# EAGLE design VoltageSourcePCBV3LT1494 (EAGLE 9.4.2)
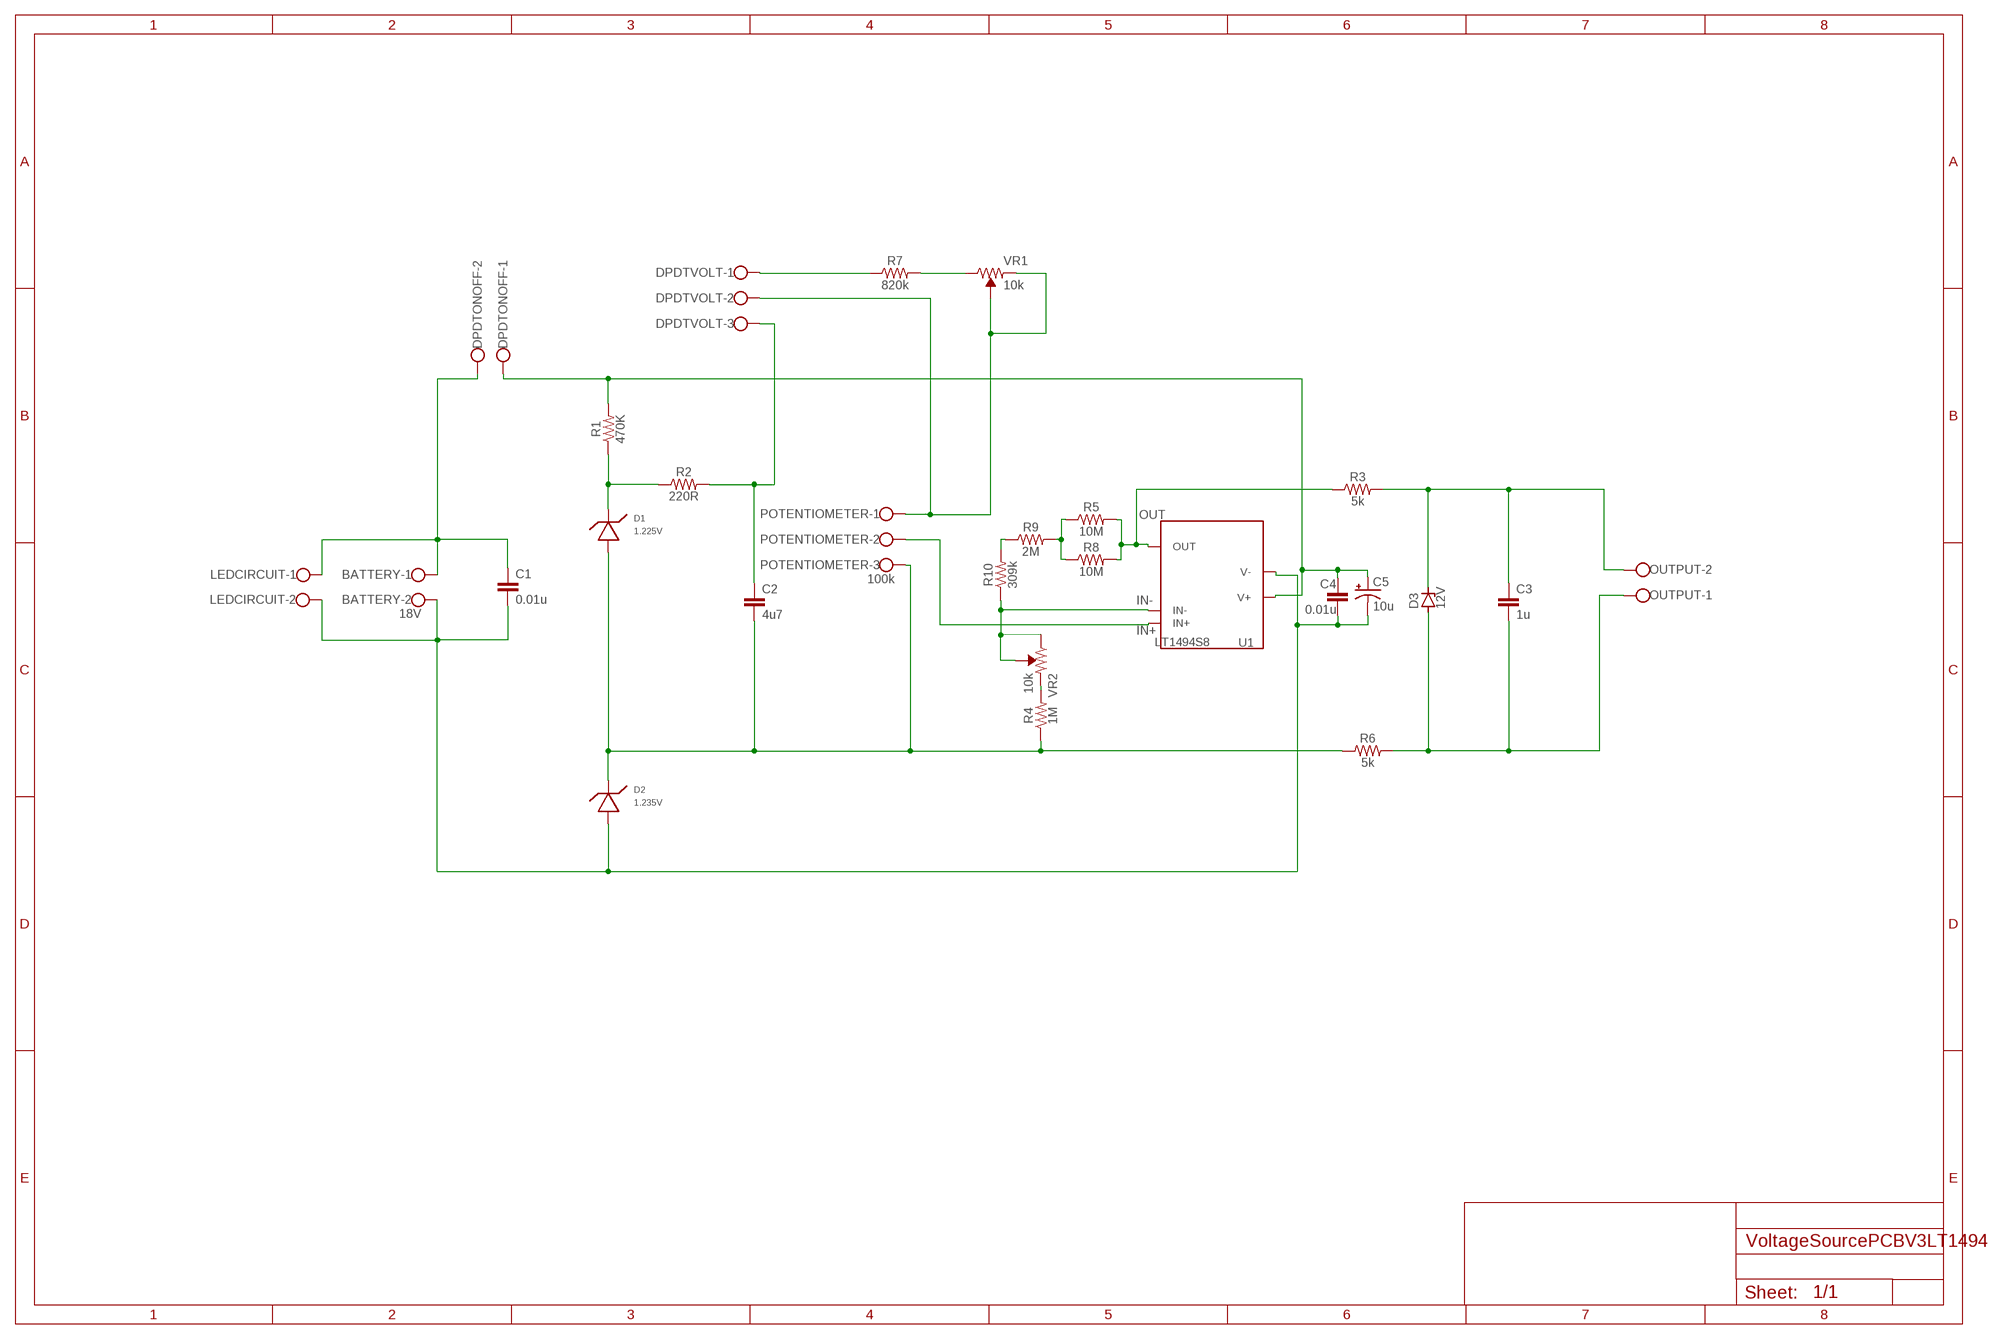
[diagram p0: schematic, sheet 1]

## Parts
BATTERY  18V  W237-102  [W237-102]
C1  0.01u  0.33UF/330NF-0805-50V-10%  [0805]
C2  4u7  0.33UF/330NF-0805-50V-10%  [0805]
C3  1u  0.33UF/330NF-0805-50V-10%  [0805]
C4  0.01u  0.33UF/330NF-0805-50V-10%  [0805]
C5  10u  100UF-POLAR-EIA7343-10V-10%(TANT)  [EIA7343]
D1  1.225V  LT1004CS8SMD  [S8PACKAGE]
D2  1.235V  LM385BDSMD  [SOIC-8PACKAGE]
D3  12V  ZENER-DIODESOT23  [SOT23]
DPDTONOFF  W237-102  [W237-102]
DPDTVOLT  W237-103  [W237-103]
LEDCIRCUIT  W237-102  [W237-102]
OUTPUT  W237-102  [W237-102]
POTENTIOMETER  100k  W237-103  [W237-103]
R1  470K  RESISTOR0805  [0805]
R2  220R  RESISTOR0805  [0805]
R3  5k  RESISTOR0805  [0805]
R4  1M  RESISTOR0805  [0805]
R5  10M  RESISTOR0805  [0805]
R6  5k  RESISTOR0805  [0805]
R7  820k  RESISTOR0805  [0805]
R8  10M  RESISTOR0805  [0805]
R9  2M  RESISTOR0805  [0805]
R10  309k  RESISTOR0805  [0805]
U1  LT1494S8  [S8PACKAGE]
VR1  10k  TRIMPOT-SMD-3MM-OPEN-1/10W-25%  [TRIMPOT-SMD-TC33X]
VR2  10k  TRIMPOT-SMD-3MM-OPEN-1/10W-25%  [TRIMPOT-SMD-TC33X]

## Nets
IN+: POTENTIOMETER.2 U1.3(IN+)
IN-: R10.1 U1.2(IN-) VR2.1(CW) VR2.2(WIPER)
N$2: BATTERY.1 C1.1 DPDTONOFF.2 LEDCIRCUIT.1
N$6: D1.6(CATHODE) D1.8(CATHODE) R1.1 R2.1
N$7: C2.2 D1.4(ANODE) D2.8(CATHODE) POTENTIOMETER.3 R4.1 R6.1
N$8: C2.1 DPDTVOLT.3 R2.2
N$11: DPDTVOLT.2 POTENTIOMETER.1 VR1.2(WIPER) VR1.3(CCW)
N$12: DPDTVOLT.1 R7.1
N$15: R5.1 R8.1 R9.2
N$16: C3.1 D3.3(C) OUTPUT.2 R3.2
N$17: C3.2 D3.1(A) OUTPUT.1 R6.2
N$18: R4.2 VR2.3(CCW)
N$19: R7.2 VR1.1(CW)
N$20: R9.1 R10.2
OUT: R3.1 R5.2 R8.2 U1.6(OUT)
V+: C4.1 C5.A(+) DPDTONOFF.1 R1.2 U1.7(V+)
V-: BATTERY.2 C1.2 C4.2 C5.C(-) D2.4(ANODE) LEDCIRCUIT.2 U1.4(V-)

## Library data of the parts
BATTERY DPDTONOFF LEDCIRCUIT OUTPUT = con-wago-500:W237-102: WAGO SCREW CLAMP; MPN: 237-102; OC_FARNELL: unknown; OC_NEWARK: 70K9898
C1-C4 = SparkFun-Capacitors:0.33UF/330NF: 0.33µF/330nF ceramic capacitors A capacitor is a passive two-terminal electrical component used to store electrical energy temporarily in an electric field.; PROD_ID: CAP-08469; VALUE: 0.33µF
C5 = SparkFun-Capacitors:100UF-POLAR: 100µF polarized capacitors A capacitor is a passive two-terminal electrical component used to store electrical energy temporarily in an electric field.; PROD_ID: CAP-07890; VALUE: 100uF
D1 = RequiredComponents:LT1004CS8: This is a micropower voltage reference (similar to zener diode) and is contained inside of an S8 package
D2 = RequiredComponents:LM385BD: This is a micropower voltage controller, which is similar to a zener diode, in a SOIC-8 package
D3 = diode:ZENER-DIODE: Z-Diode
DPDTVOLT POTENTIOMETER = con-wago-500:W237-103: WAGO SCREW CLAMP; MPN: 237-103; OC_FARNELL: unknown; OC_NEWARK: 18M7116
R1-R10 = SparkFun-Resistors:RESISTOR: Generic Resistor Package
U1 = RequiredComponents:LT1494: The LT1494 is a very low current op-amp that also has a good noise output, powered by a 36V supply (18V each pin)
VR1 VR2 = SparkFun-Resistors:TRIMPOT: Trimming Potentiometer (Trimpot) Three-terminal potentiometers, with an adjustable wiper and two adjustable resistors. A pot can be used to create a configurable voltage divider, or as a variable resistor. "Trimpots" are a subset of potentiometers, usually intended for "set-and-forget" applications. They're often more delicate than standard potentiometers - rated for fewer turns. Variants PTH-KNOB - PTH Trimpot w/ finger-adjustable knob Trimpot 10K with Knob <https://www.sparkfun.com/products/9806> (COM-09806) Datasheet <http://www.sparkfun.com/datasheets/Components/General/TSR-3386.pdf> SMD-3MM-CLOSED-FRAME - SMD 3mm Square Closed-Frame Trimpot Used on e.g. EasyDriver - Stepper Motor Driver <https://www.sparkfun.com/products/12779> Datasheet <http://www.bitechnologies.com/pdfs/22.pdf> (22AR10KTR) SMD-5MM - SMD 5mm Square Closed-Frame Trimpot Used on e.g. IOIO-OTG - V2.2 <https://www.sparkfun.com/products/13613> Datasheet <http://www.vishay.com/docs/51008/ts53.pdf> (TS53YL502MR10) SMD-3MM-1/10W-25% - 3mm Square Open-Frame Trimpot Used on e.g. SparkFun Shapeoko <https://www.sparkfun.com/products/13899> Datasheet <http://www.bourns.com/docs/Product-Datasheets/TC33.pdf> (TC33X-2-103E); PROD_ID: RES-12428, RES-08048

## Board
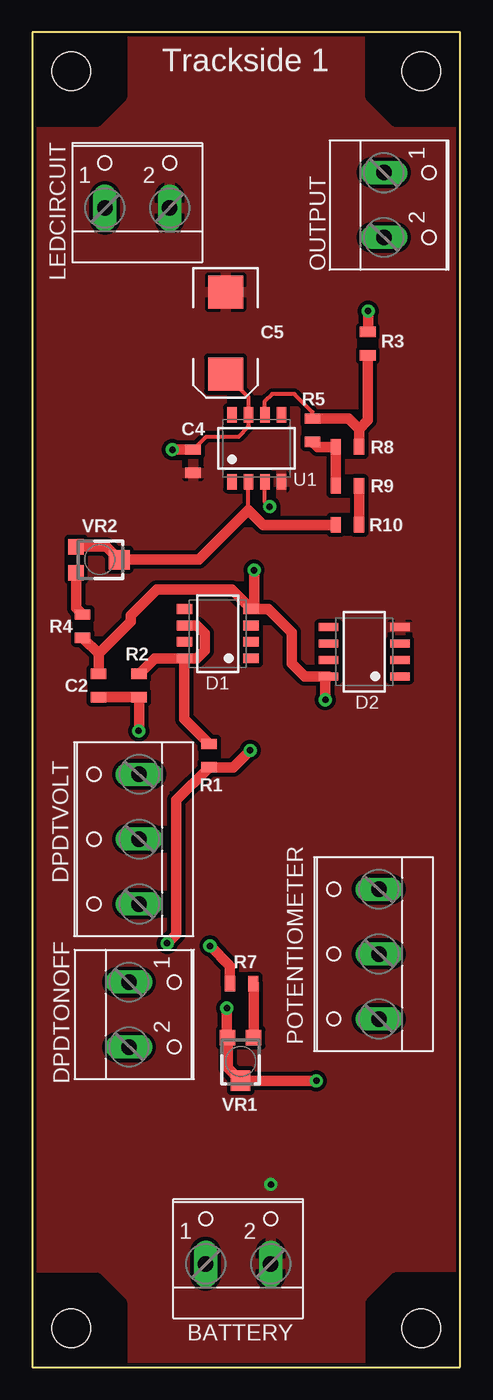
[diagram p1: board, top side]
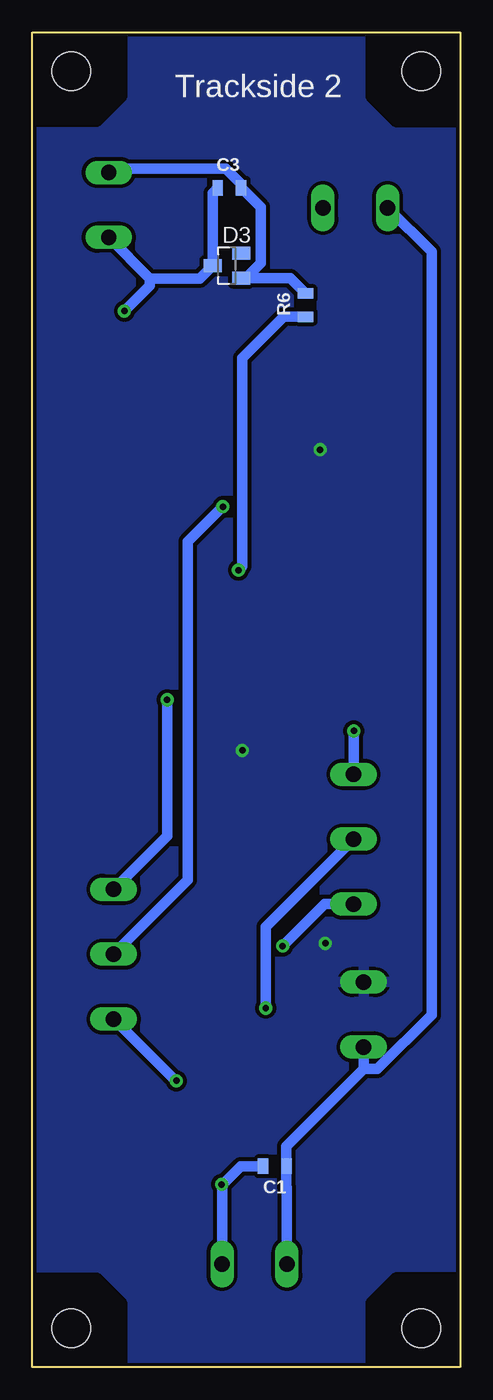
[diagram p2: board, bottom side, seen from below]

Size 33 x 103 mm. Coordinates in mm from the lower left corner, seen from the top.
Outline: 33,0 33,103
Outline: 33,103 0,103
Outline: 33,0 33,103
Outline: 33,103 0,103
Outline: 0,103 0,0 33,0
Copper layers (1*16): Top 0.035mm / dielectric 1.5mm / Bottom 0.035mm
Design rules "PCBTrain": minimum track width 8mil, minimum drill 0.2mm, track to track 0.3mm, track to pad 0.3mm, pad to pad 8mil, via to via 8mil, smd to smd 8mil, copper to edge 0.25mm, drill to drill 8mil, minimum pad ring 12mil, minimum via ring 10mil, stop-mask expansion 4mil, vias tented up to drill 20mil, thermal gap 10mil
Holes 3 mm at 3,3 30,3 3,100 30,100
tRestrict: 12 lines
bRestrict: 12 lines

### Footprints (pad centres in the part's own frame; a part is rotated, then mirrored left to right if it is on the bottom)
W237-102 = drill 1.194 long: 1 -2.5,-1.27; 2 2.5,-1.27
0805 = smd 0.8 x 1.2: 1 -0.9,0; 2 0.9,0
EIA7343 = smd 2.55 x 2.7: A 3.17,0; C -3.17,0
S8PACKAGE = smd 0.75 x 1.2: 1 -1.905,-2.578; 2 -0.635,-2.578; 3 0.635,-2.578; 4 1.905,-2.578; 5 1.905,2.578; 6 0.635,2.578; 7 -0.635,2.578; 8 -1.905,2.578
SOIC-8PACKAGE = smd 0.6 x 1.52: 1 -1.905,-2.76; 2 -0.635,-2.76; 3 0.635,-2.76; 4 1.905,-2.76; 5 1.905,2.76; 6 0.635,2.76; 7 -0.635,2.76; 8 -1.905,2.76
SOT23 = smd 1 x 1.4: 1 -0.95,-1.1; 2 0.95,-1.1; 3 0,1.1
W237-103 = drill 1.194 long: 1 -5,-1.29; 2 0,-1.29; 3 5,-1.29
TRIMPOT-SMD-TC33X = smd 1.2 x 1.2: 1 -1,-1.825; 3 1,-1.825 | smd 1.5 x 1.6: 2 0,1.5

### Placement (x,y rotation side)
BATTERY  15.87,9.23 0 top
C1  14.3,15.5 180 bottom
C2  5.1,52.6 90 top
C3  17.8,91 0 bottom
C4  12.4,69.9 270 top
C5  14.9,79.8 270 top
D1  14.3,56.6 90 top
D2  25.6,55.2 90 top
D3  18,85 90 bottom
DPDTONOFF  8.72,27.21 270 top
DPDTVOLT  6.94,40.74 90 top
LEDCIRCUIT  8.09,90.72 0 top
OUTPUT  28.38,89.68 270 top
POTENTIOMETER  25.44,31.87 90 top
R1  13.63,47.19 270 top
R2  8.23,52.6 270 top
R3  25.87,78.99 90 top
R4  3.87,57.18 90 top
R5  21.6,72.3 90 top
R6  11.92,81.95 90 bottom
R7  16.14,29.58 0 top
R8  24.3,71 0 top
R9  24.3,68 180 top
R10  24.3,65 0 top
U1  17.3,70.9 0 top
VR1  16.06,23.6 180 top
VR2  5.2,62.31 270 top

### Tracks (layer width: path | path; a pad name or v marks a point on that pad's centre or on a via)
IN+  (via drill 0.5)
  Top 0.305: v18.3,66.4 17.93,66.77 U1.3
  Bottom 0.813: v18.3,66.4 21,63.7 21,37.6 POTENTIOMETER.2
IN-
  Top 0.305: 16.66,66.14 U1.2
  Top 0.813: VR2.1 5.7,63.31 VR2.2 12.84,62.31 16.66,66.14 17.8,65 R10.1
N$2
  Bottom 0.813: DPDTONOFF.2 7.45,23 | BATTERY.1 13.37,13.87 13.4,13.9 C1.1 13.4,17.05 7.45,23 | 7.45,23 6.4,23 2.2,27.2 2.2,86.06 LEDCIRCUIT.1
N$6
  Top 0.813: R2.1 9.43,54.7 D1.8 | R1.1 11.72,50 D1.8 | D1.8 12.7,54.7 13.3,55.3 13.3,56.6 12.66,57.23 D1.6
N$7  (via drill 0.5)
  Top 0.813: v17.1,61.5 17.1,58.73 D1.4 | R4.1 5.1,55.05 | 5.1,55.05 C2.2 | 5.1,55.05 7.6,57.55 7.6,58 9.6,60 15.38,60 D1.4 | D1.4 18.2,58.51 20,56.7 20,54.3 21,53.3 D2.8 22.6,53.05 v22.6,51.5
  Bottom 0.813: v22.6,51.5 22.6,41 POTENTIOMETER.3 | R6.1 13.62,81.05 16.8,77.87 16.8,61.8 v17.1,61.5
N$8  (via drill 0.5)
  Top 0.813: C2.1 R2.2 8.23,49.13 v8.2,49.1
  Bottom 0.813: v8.2,49.1 8.2,45.77 DPDTVOLT.3
N$11  (via drill 0.5)
  Top 0.813: v21.9,22.1 VR1.2 15.06,23.1 VR1.3 15,25.48 v15,27.7
  Bottom 0.813: POTENTIOMETER.1 21.96,22.1 v21.9,22.1 | DPDTVOLT.2 15,33.97 v15,27.7
N$12  (via drill 0.5)
  Top 0.813: v13.7,32.5 15.24,30.96 R7.1
  Bottom 0.813: DPDTVOLT.1 10.46,35.74 v13.7,32.5
N$15
  Top 0.813: R9.2 R8.1 22,71 R5.1
N$16  (via drill 0.5)
  Top 0.813: R3.2 25.9,79.92 v25.9,81.5
  Bottom 0.813: OUTPUT.2 23.93,84 | 23.93,84 20.1,84 D3.3 19.1,90.6 C3.1 | v25.9,81.5 23.93,83.47 23.93,84
N$17
  Bottom 0.813: OUTPUT.1 26.79,92.5 18.1,92.5 16.9,91.3 C3.2 15.4,89.5 15.4,85.2 16.55,84.05 D3.1 13.12,84.05 R6.2
N$18
  Top 0.813: R4.2 3.38,58.58 VR2.3
N$19
  Top 0.813: VR1.1 17.06,29.56 R7.2
N$20
  Top 0.813: R9.1 R10.2
OUT
  Top 0.305: R5.2 21.6,73.7 20.2,75.1 18.5,75.1 17.9,74.5 17.9,73.51 U1.6
  Top 0.813: R5.2 24.4,73.2 25.2,72.4 | 25.2,72.4 R8.2 | R3.1 25.87,73.07 25.2,72.4
V+  (via drill 0.5)
  Top 0.305: C5.A 16.66,74.86 U1.7 16.7,73.44 16.7,72.6 15.9,71.8 13.4,71.8 C4.1
  Top 0.813: v10.4,32.7 11.1,33.4 11.1,43.76 R1.2 15.49,46.29 v16.8,47.6 | C4.1 v10.8,70.8
  pour Bottom: 0,103 33,103 33,0 0,0
V-  (via drill 0.5)
  Bottom 0.813: 18.37,14.07 v18.4,14.1 | BATTERY.2 18.37,14.07 | C1.2 16.94,15.5 18.37,14.07
  pour Top: 0,103 33,103 33,0 0,0

### Text on the board
tPlace: Trackside 1
bPlace: Trackside 2